# EAGLE design piezo-jfet-buffer-simple (EAGLE 7.2.0)
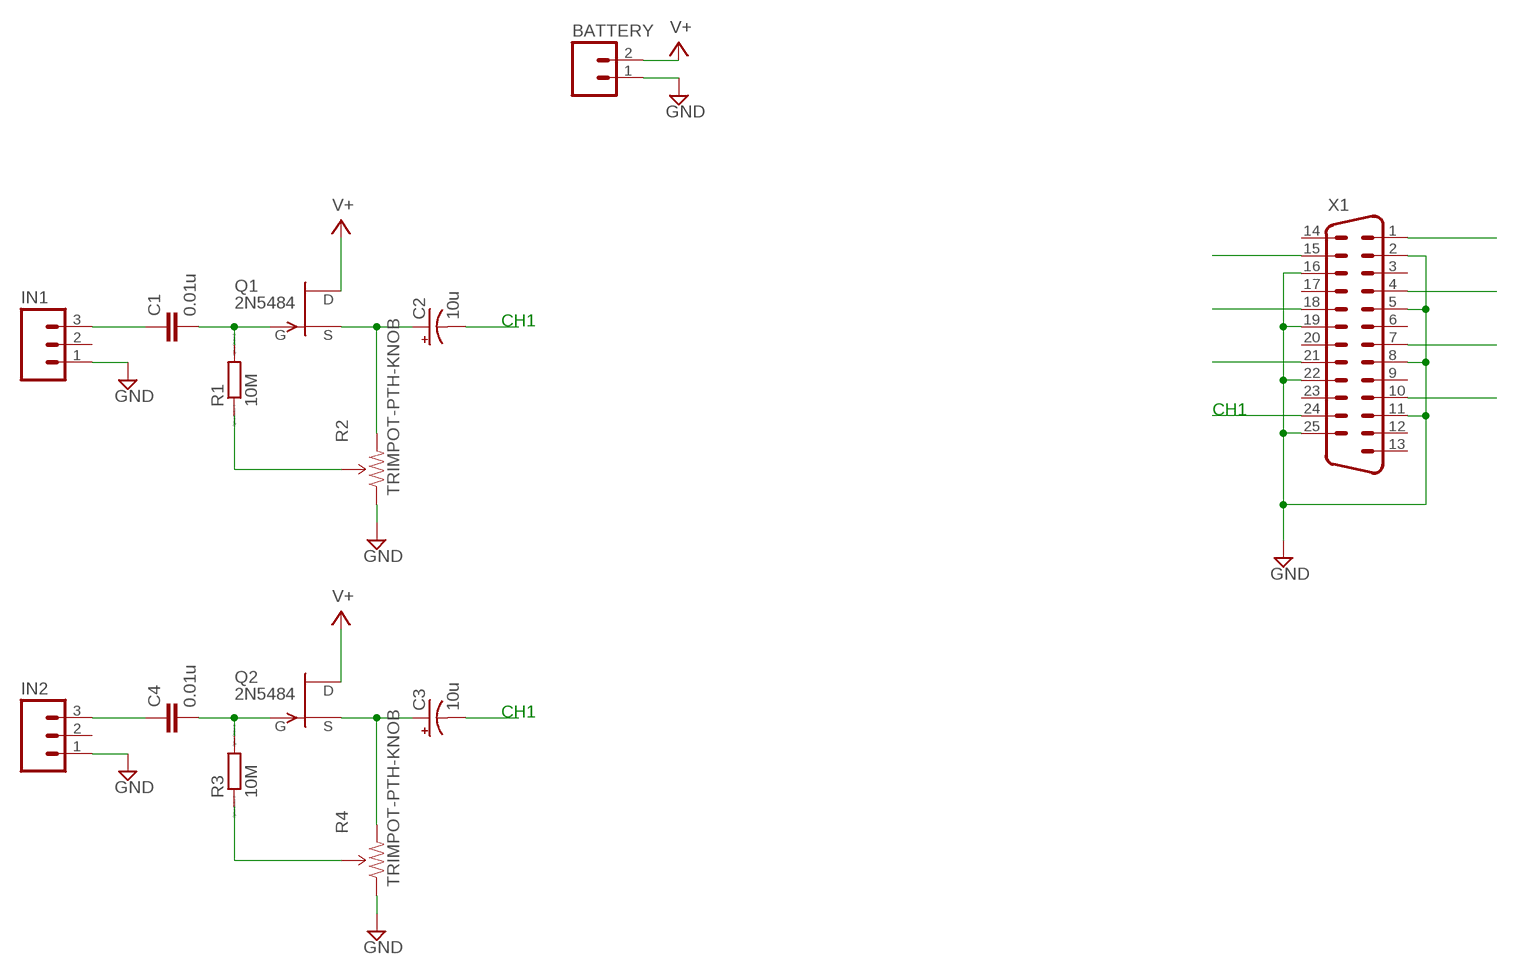
[diagram p0: schematic, sheet 1]

## Parts
BATTERY  M02PTH  [1X02]
C1  0.01u  C5/3  [C5B3]
C2  10u  CAP_POLPTH2  [CPOL-RADIAL-10UF-25V]
C3  10u  CAP_POLPTH2  [CPOL-RADIAL-10UF-25V]
C4  0.01u  C5/3  [C5B3]
IN1  M03LOCK  [1X03_LOCK]
IN2  M03LOCK  [1X03_LOCK]
Q1  2N5484  [TO92-]
Q2  2N5484  [TO92-]
R1  10M  R0204/7  [0204/7]
R2  TRIMPOT-PTH-KNOB  [3386U]
R3  10M  R0204/7  [0204/7]
R4  TRIMPOT-PTH-KNOB  [3386U]
X1  DB25H  [M25H]

## Nets
CH1: C2.2(-) X1.24
CH2: C3.2(-) X1.10
CH3: X1.21
CH4: X1.7
CH5: X1.18
CH6: X1.4
CH7: X1.15
CH8: X1.1
GND: BATTERY.1 IN1.1 IN2.1 R2.1(CCW) R4.1(CCW) X1.2 X1.5 X1.8 X1.11 X1.16 X1.19 X1.22 X1.25
JFET-GATE: C1.2 Q1.1(G) R1.2
JFET-GATE1: C4.2 Q2.1(G) R3.2
JFET-SOURCE: C2.1(+) Q1.2(S) R2.3(CW)
JFET-SOURCE1: C3.1(+) Q2.2(S) R4.3(CW)
N$1: C1.1 IN1.3
N$2: C4.1 IN2.3
N$3: R1.1 R2.2(WIPER)
N$4: R3.1 R4.2(WIPER)
V+: BATTERY.2 Q1.3(D) Q2.3(D)
Unconnected: IN1.2 IN2.2 X1.3 X1.6 X1.9 X1.12 X1.13 X1.14 X1.17 X1.20 X1.23

## Notes on the sheet
- CH1
- CH1
- CH1

## Library data of the parts
BATTERY = SparkFun-Connectors:M02: Header 2 Standard 2-pin 0.1" header. Use with straight break away headers (SKU : PRT-00116), right angle break away headers (PRT-00553), swiss pins (PRT-00743), machine pins (PRT-00117), and female headers (PRT-00115). Molex polarized connector foot print use with SKU : PRT-08233 with associated crimp pins and housings.
C1 C4 = capacitor-wima:C: CAPACITOR naming: grid - package width
C2 C3 = SparkFun-Passives:CAP_POL: Capacitor Polarized These are standard SMD and PTH capacitors. Normally 10uF, 47uF, and 100uF in electrolytic and tantalum varieties. Always verify the external diameter of the through hole cap, it varies with capacity, voltage, and manufacturer. The EIA devices should be standard.
IN1 IN2 = SparkFun-Connectors:M03: Header 3 Standard 3-pin 0.1" header. Use with straight break away headers (SKU : PRT-00116), right angle break away headers (PRT-00553), swiss pins (PRT-00743), machine pins (PRT-00117), and female headers (PRT-00115). Molex polarized connector foot print use with SKU : PRT-08232 with associated crimp pins and housings.
Q1 Q2 = transistor-fet:?548*: N-Channel JFETs Source: VISHAY 2N5484.pdf Compatible: TO92 2N5245 J304 J305 U310 J308 J309 J310 TO72 2N4416 2N4416A 2N3823 2N4351 3N169 3N170 3N171 MFE3002 TO18 2N3796 2N3797 MFE825 Source: Motorola European Master Guide Pacge 3-59
R1 R3 = eagle-ltspice:R: RESISTOR, European symbol; SPICEMODEL: NONE; SPICEPREFIX: R
R2 R4 = SparkFun-Electromechanical:TRIMPOT: Various small potentiometers for "set-and-forget" applications
X1 = SparkFun-Connectors:DB25: Various DB25 connectors

## Board
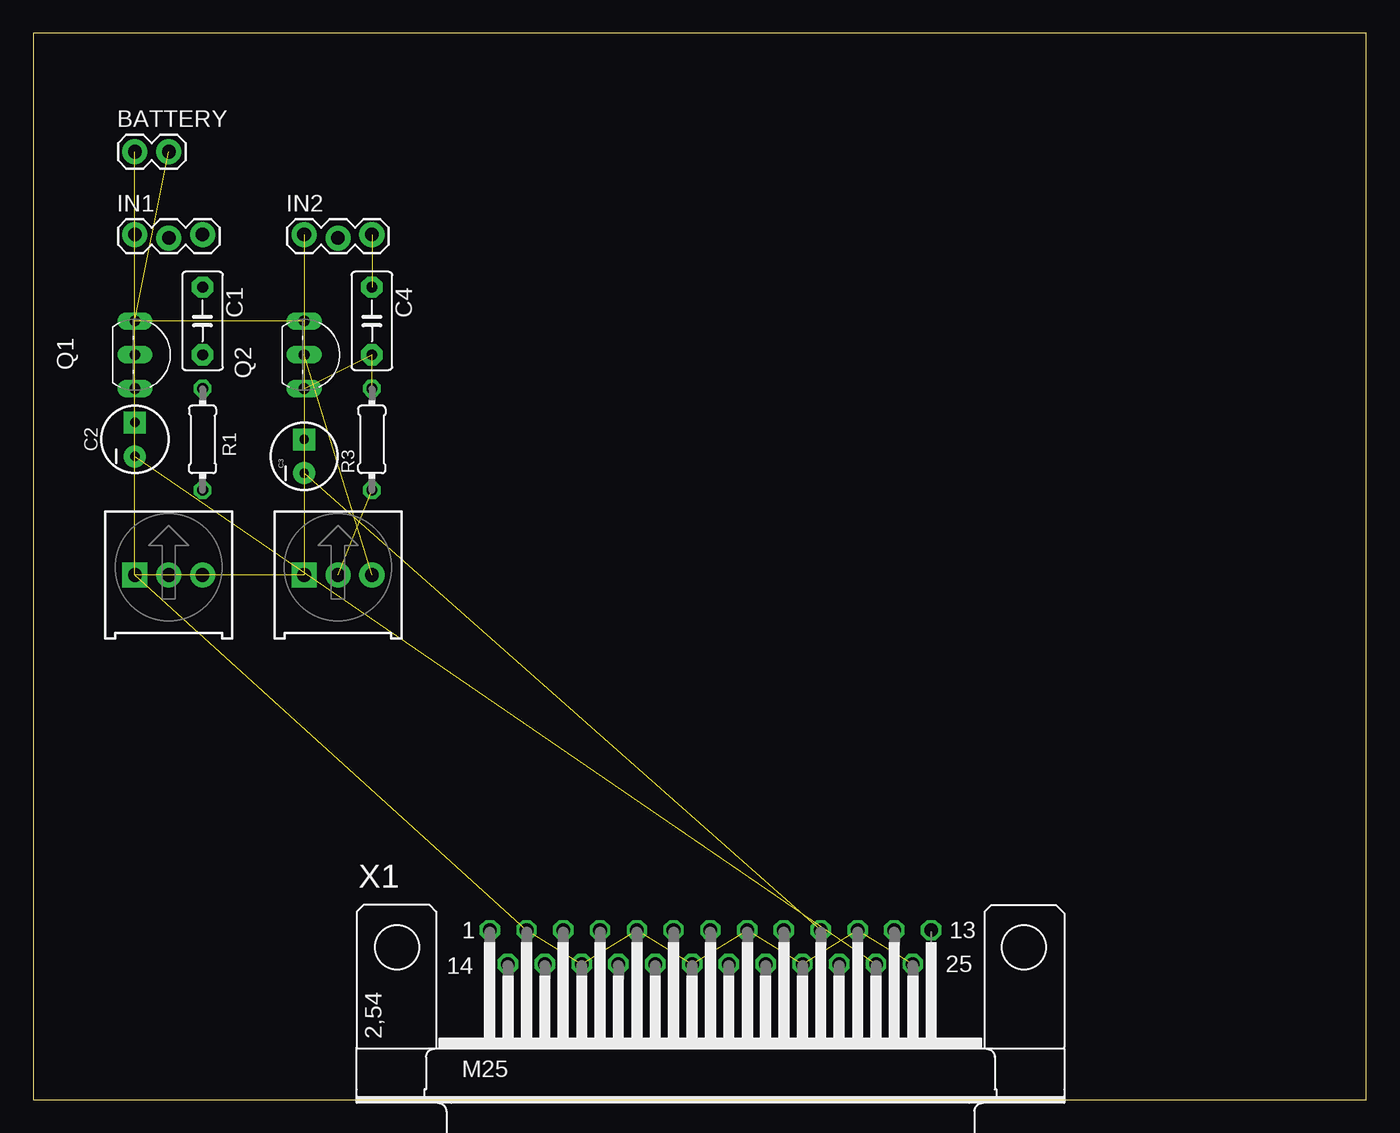
[diagram p1: board, top side]
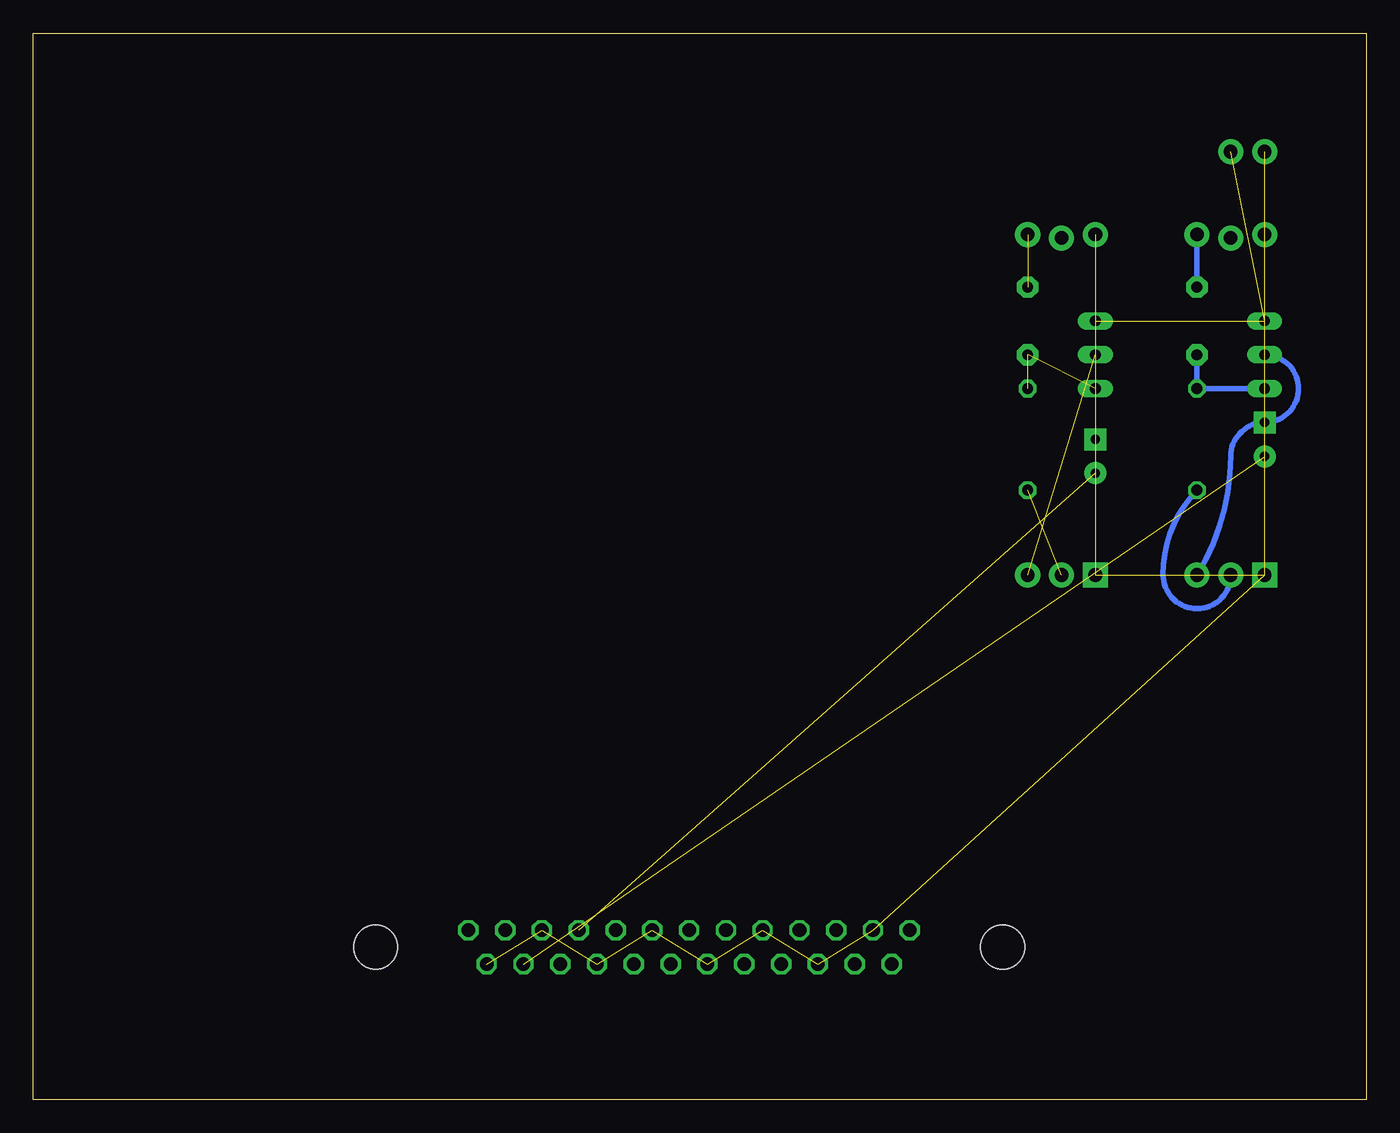
[diagram p2: board, bottom side, seen from below]

Size 100 x 80 mm. Coordinates in mm from the lower left corner, seen from the top.
Outline: 0,0 100,0 100,80 0,80 0,0
Copper layers (1*16): Top 0.035mm / dielectric 1.5mm / Bottom 0.035mm
Design rules "default": minimum track width 10mil, minimum drill 24mil, track to track 8mil, track to pad 8mil, pad to pad 8mil, via to via 8mil, smd to smd 8mil, copper to edge 40mil, drill to drill 8mil, minimum pad ring 10mil, minimum via ring 8mil, stop-mask expansion 4mil, vias tented up to drill 0mil, thermal gap 10mil

### Footprints (pad centres in the part's own frame; a part is rotated, then mirrored left to right if it is on the bottom)
1X02 = drill 1.016 pad 1.88: 1 0,0; 2 2.54,0
C5B3 = drill 0.813 pad 1.6 octagon: 1 -2.54,0; 2 2.54,0
CPOL-RADIAL-10UF-25V = drill 0.7 pad 1.651 square: 1 1.27,0 | drill 0.7 pad 1.651: 2 -1.27,0
1X03_LOCK = drill 1.016 pad 1.88: 1 0,0.127; 2 2.54,-0.127; 3 5.08,0.127
TO92- = drill 0.813 long: 1 2.54,0; 2 0,0; 3 -2.54,0
0204/7 = drill 0.813 octagon: 1 -3.81,0; 2 3.81,0
3386U = drill 1.016 pad 1.88 square: 1 -2.54,-0.015 | drill 1.016 pad 1.88: 2 0,-0.015; 3 2.54,-0.015
M25H = drill 1.016 octagon: 1 -16.561,1.27; 2 -13.792,1.27; 3 -11.049,1.27; 4 -8.28,1.27; 5 -5.512,1.27; 6 -2.769,1.27; 7 0,1.27; 8 2.769,1.27; 9 5.512,1.27; 10 8.28,1.27; 11 11.049,1.27; 12 13.792,1.27; 13 16.561,1.27; 14 -15.189,-1.27; 15 -12.421,-1.27; 16 -9.652,-1.27; 17 -6.909,-1.27; 18 -4.14,-1.27; 19 -1.372,-1.27; 20 1.372,-1.27; 21 4.14,-1.27; 22 6.909,-1.27; 23 9.652,-1.27; 24 12.421,-1.27; 25 15.189,-1.27 | hole 3.302: 23.52,0; -23.52,0

### Placement (x,y rotation side)
BATTERY  7.62,71.12 0 top
C1  12.7,58.42 270 top
C2  7.62,49.53 90 top
C3  20.32,48.26 90 top
C4  25.4,58.42 270 top
IN1  7.62,64.77 0 top
IN2  20.32,64.77 0 top
Q1  7.62,55.88 270 top
Q2  20.32,55.88 270 top
R1  12.7,49.53 90 top
R2  10.16,39.37 0 top
R3  25.4,49.53 90 top
R4  22.86,39.37 0 top
X1  50.8,11.43 0 top

### Tracks (layer width: path | path; a pad name or v marks a point on that pad's centre or on a via)
CH1  (1 unrouted)
CH2  (1 unrouted)
GND  (12 unrouted)
JFET-GATE
  Bottom 0.406: C1.2 R1.2 Q1.1
JFET-GATE1  (2 unrouted)
JFET-SOURCE
  Bottom 0.406: Q1.2 arc90 5.08,53.34 arc90 C2.1 arc-90 10.16,48.26 arc32 R2.3
JFET-SOURCE1  (2 unrouted)
N$1
  Bottom 0.406: IN1.3 C1.1
N$2  (1 unrouted)
N$3
  Bottom 0.406: R2.2 arc90 12.69,36.83 12.7,36.83 arc90 15.24,39.37 arc44 R1.1
N$4  (1 unrouted)
V+  (2 unrouted)